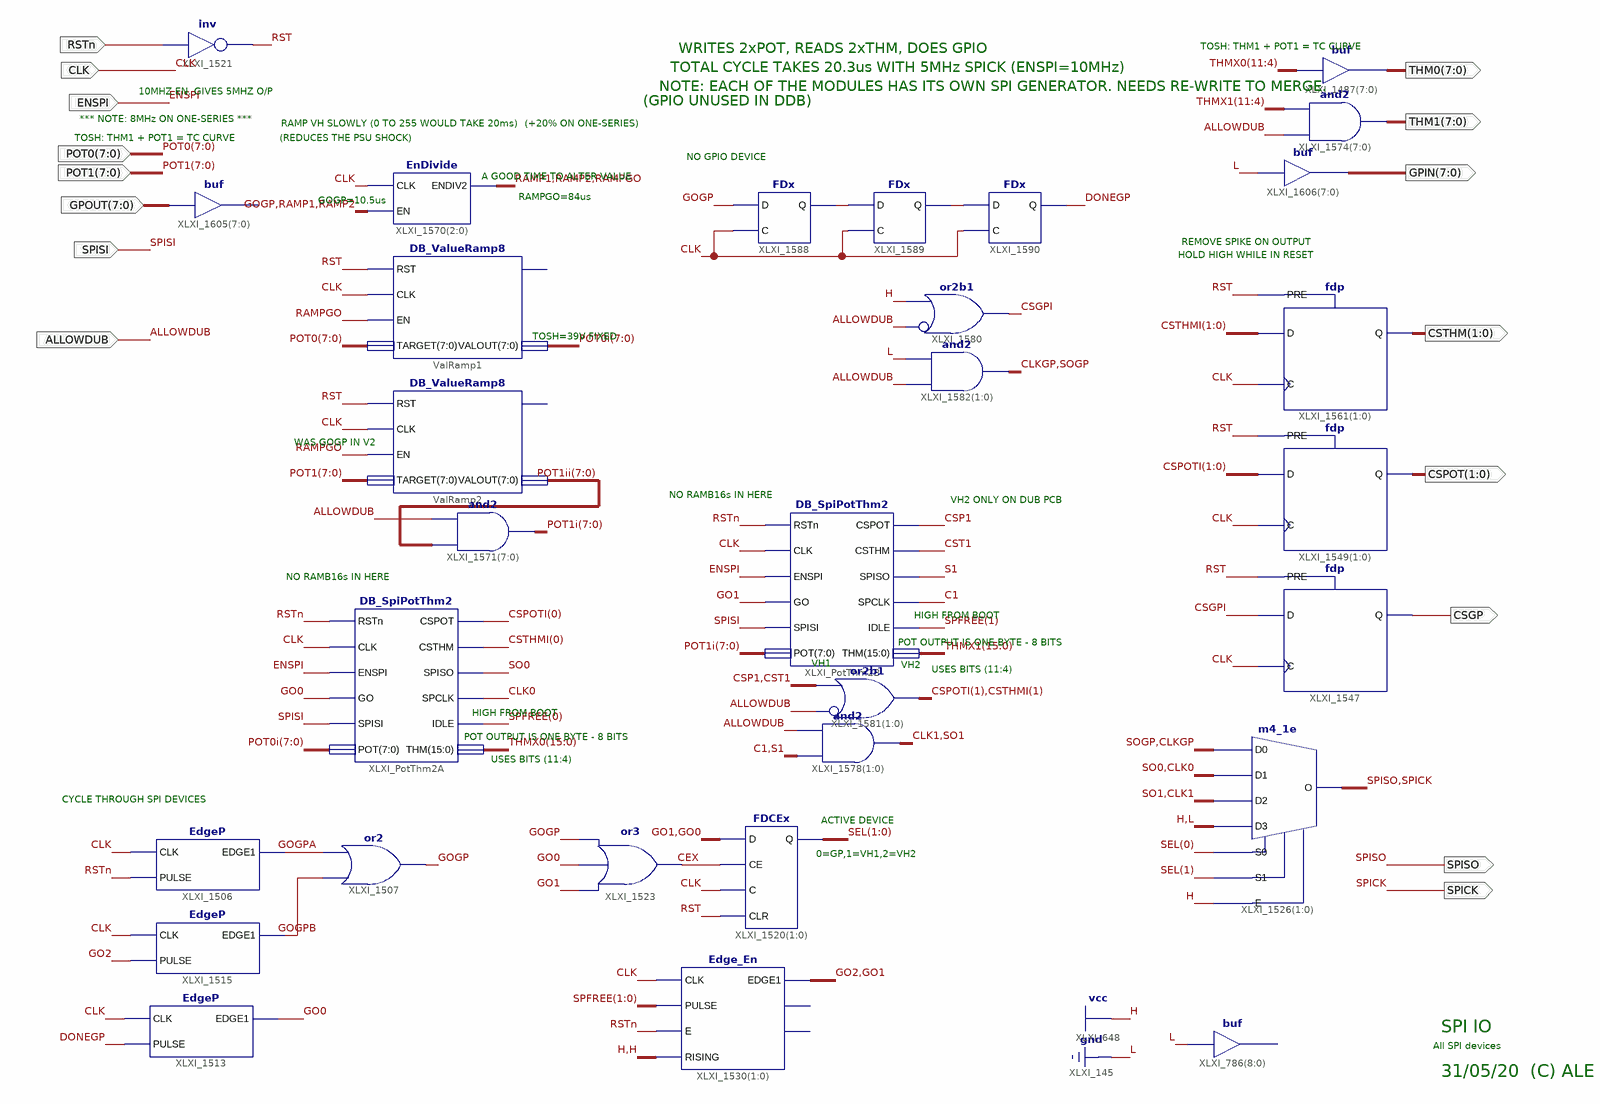
[diagram p0: schematic sheet 1]
// Xilinx ISE schematic DB_SpiIo.sch (spartan3e) as structural Verilog: 30 symbols, 16 ports
module DB_SpiIo (
  input  CLK,
  input  RSTn,
  input  ENSPI,
  input  SPISI,
  input  [7:0] GPOUT,
  input  [7:0] POT1,
  input  [7:0] POT0,
  input  ALLOWDUB,
  output SPISO,
  output SPICK,
  output CSGP,
  output [1:0] CSPOT,
  output [1:0] CSTHM,
  output [7:0] THM0,
  output [7:0] GPIN,
  output [7:0] THM1
);

  wire C1, CEX, CLK0, CLK1, CLKGP, CSGPI, CSP1, CST1, DONEGP, GO0, GO1, GO2, GOGP, GOGPA, GOGPB, RAMP1,
       RAMP2, RAMPGO, RST, S1, SO0, SO1, SOGP, XLXN_11, XLXN_12;
  wire [1:0] CSPOTI, CSTHMI, SEL, SPFREE;
  wire [7:0] POT0i, POT1i, POT1ii;
  wire [15:0] THMX0, THMX1;

  not XLXI_1521 (RST, RSTn);
  FDCEx XLXI_1520[1:0] (.C(CLK), .CE(CEX), .CLR(RST), .D({GO1, GO0}), .Q(SEL));
  or XLXI_1523 (CEX, GO1, GO0, GOGP);
  Edge_En XLXI_1530[1:0] (
    .CLK(CLK), .E(RSTn), .EDGE1({GO2, GO1}), .PULSE(SPFREE), .RISING(2'b11));  // open: EDGE0, EDGEQUICK
  EdgeP XLXI_1515 (.CLK(CLK), .EDGE1(GOGPB), .PULSE(GO2));
  EdgeP XLXI_1506 (.CLK(CLK), .EDGE1(GOGPA), .PULSE(RSTn));
  or XLXI_1507 (GOGP, GOGPB, GOGPA);
  EdgeP XLXI_1513 (.CLK(CLK), .EDGE1(GO0), .PULSE(DONEGP));
  // buf XLXI_786[8..0] has open pins: I=1'b0, O=open
  m4_1e XLXI_1526[1:0] (
    .D0({SOGP, CLKGP}), .D1({SO0, CLK0}), .D2({SO1, CLK1}), .D3(2'b10), .E(1'b1), .S0(SEL[0]), .S1(SEL[1]),
    .O({SPISO, SPICK}));
  fdp XLXI_1547 (.C(CLK), .D(CSGPI), .PRE(RST), .Q(CSGP));
  fdp XLXI_1549[1:0] (.C(CLK), .D(CSPOTI), .PRE(RST), .Q(CSPOT));
  fdp XLXI_1561[1:0] (.C(CLK), .D(CSTHMI), .PRE(RST), .Q(CSTHM));
  FDx XLXI_1588 (.C(CLK), .D(GOGP), .Q(XLXN_11));
  FDx XLXI_1589 (.C(CLK), .D(XLXN_11), .Q(XLXN_12));
  FDx XLXI_1590 (.C(CLK), .D(XLXN_12), .Q(DONEGP));
  or XLXI_1580 (CSGPI, ~ALLOWDUB, 1'b1);  // or2b1
  assign {CLKGP, SOGP} = {2{ALLOWDUB}} & 2'b00;  // and2 XLXI_1582[1..0], 2 bits wide
  // buf XLXI_1605[7..0] has open pins: I=GPOUT, O=open
  assign THM0 = THMX0[11:4];  // buf XLXI_1487[7..0], 8 bits wide
  assign THM1 = {8{ALLOWDUB}} & THMX1[11:4];  // and2 XLXI_1574[7..0], 8 bits wide
  assign GPIN = {8{1'b0}};  // buf XLXI_1606[7..0], 8 bits wide
  DB_SpiPotThm2 XLXI_PotThm2B (
    .RSTn(RSTn), .CLK(CLK), .ENSPI(ENSPI), .GO(GO1), .SPISI(SPISI), .POT(POT1i), .CSPOT(CSP1), .CSTHM(CST1),
    .SPISO(S1), .SPCLK(C1), .IDLE(SPFREE[1]), .THM(THMX1));
  assign {CLK1, SO1} = {C1, S1} & {2{ALLOWDUB}};  // and2 XLXI_1578[1..0], 2 bits wide
  assign {CSPOTI[1], CSTHMI[1]} = ~{2{ALLOWDUB}} | {CSP1, CST1};  // or2b1 XLXI_1581[1..0], 2 bits wide
  DB_SpiPotThm2 XLXI_PotThm2A (
    .RSTn(RSTn), .CLK(CLK), .ENSPI(ENSPI), .GO(GO0), .SPISI(SPISI), .POT(POT0i), .CSPOT(CSPOTI[0]),
    .CSTHM(CSTHMI[0]), .SPISO(SO0), .SPCLK(CLK0), .IDLE(SPFREE[0]), .THM(THMX0));
  EnDivide XLXI_1570[2:0] (.CLK(CLK), .EN({GOGP, RAMP1, RAMP2}), .ENDIV2({RAMP1, RAMP2, RAMPGO}));
  DB_ValueRamp8 ValRamp1 (.RST(RST), .CLK(CLK), .EN(RAMPGO), .TARGET(POT0), .VALOUT(POT0i));  // open: TP
  DB_ValueRamp8 ValRamp2 (.RST(RST), .CLK(CLK), .EN(RAMPGO), .TARGET(POT1), .VALOUT(POT1ii));  // open: TP
  assign POT1i = POT1ii & {8{ALLOWDUB}};  // and2 XLXI_1571[7..0], 8 bits wide

  // Notes on the sheet:
  //   TOSH: THM1 + POT1 = TC CURVE
  //   WRITES 2xPOT, READS 2xTHM, DOES GPIO
  //   TOTAL CYCLE TAKES 20.3us WITH 5MHz SPICK (ENSPI=10MHz)
  //   NOTE: EACH OF THE MODULES HAS ITS OWN SPI GENERATOR. NEEDS RE-WRITE TO MERGE.
  //   10MHZ EN. GIVES 5MHZ O/P
  //   (GPIO UNUSED IN DDB)
  //   *** NOTE: 8MHz ON ONE-SERIES ***
  //   RAMP VH SLOWLY (0 TO 255 WOULD TAKE 20ms)
  //   (+20% ON ONE-SERIES)
  //   TOSH: THM1 + POT1 = TC CURVE
  //   (REDUCES THE PSU SHOCK)
  //   NO GPIO DEVICE
  //   A GOOD TIME TO ALTER VALUE
  //   RAMPGO=84us
  //   GOGP=10.5us
  //   REMOVE SPIKE ON OUTPUT
  //   HOLD HIGH WHILE IN RESET
  //   TOSH=39V FIXED
  //   WAS GOGP IN V2
  //   NO RAMB16s IN HERE
  //   VH2 ONLY ON DUB PCB
  //   NO RAMB16s IN HERE
  //   HIGH FROM BOOT
  //   POT OUTPUT IS ONE BYTE - 8 BITS
  //   VH1
  //   VH2
  //   USES BITS (11:4)
  //   HIGH FROM BOOT
  //   POT OUTPUT IS ONE BYTE - 8 BITS
  //   USES BITS (11:4)
  //   CYCLE THROUGH SPI DEVICES
  //   ACTIVE DEVICE
  //   0=GP,1=VH1,2=VH2
  //   SPI IO
  //   All SPI devices
  //   31/05/20  (C) ALE
endmodule
